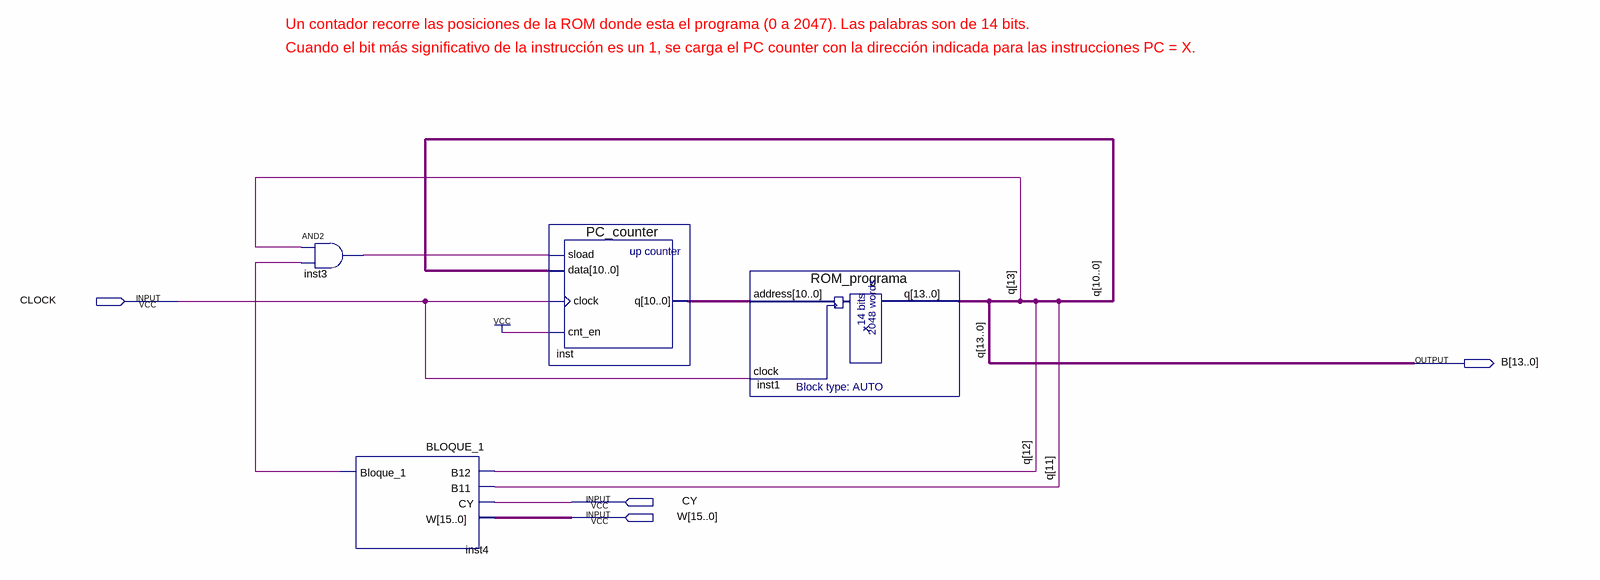
[diagram p0: schematic sheet]
// Quartus schematic IFU_block.bdf as structural Verilog: 4 symbols, 4 pins
module IFU_block (
  input  CLOCK,
  input  CY,
  input  [15:0] W,
  output [13:0] B
);

  wire inst3_out, inst4_bloque_1;
  wire [10:0] inst_q;

  and inst3 (inst3_out, B[13], inst4_bloque_1);
  BLOQUE_1 inst4 (.B12(B[12]), .B11(B[11]), .CY(CY), .W(W), .Bloque_1(inst4_bloque_1));
  PC_counter inst (.sload(inst3_out), .data(B[10:0]), .clock(CLOCK), .cnt_en(1'b1), .q(inst_q));
  ROM_programa inst1 (.address(inst_q), .clock(CLOCK), .q(B));

  // Other names for the same wires on the sheet: q[13:0] = B

  // Notes on the sheet:
  //   Un contador recorre las posiciones de la ROM donde esta el programa (0 a 2047). Las palabras son de 14 bits.
  //   Cuando el bit más significativo de la instrucción es un 1, se carga el PC counter con la dirección indicada para las instrucciones PC = X.
endmodule
